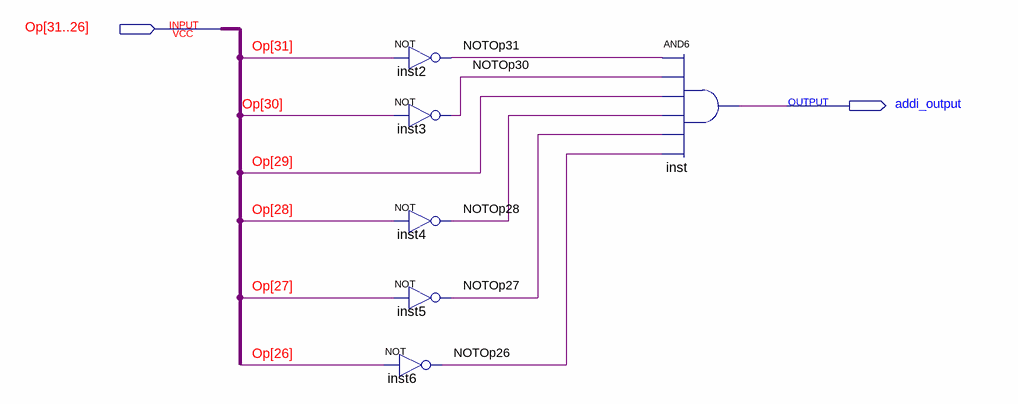
[diagram p0: schematic sheet]
// Quartus schematic ADDI.bdf as structural Verilog: 6 symbols, 2 pins
module ADDI (
  input  [31:26] Op,
  output addi_output
);

  wire NOTOp26, NOTOp27, NOTOp28, NOTOp30, NOTOp31;

  not inst2 (NOTOp31, Op[31]);
  not inst3 (NOTOp30, Op[30]);
  not inst4 (NOTOp28, Op[28]);
  not inst5 (NOTOp27, Op[27]);
  not inst6 (NOTOp26, Op[26]);
  and inst (addi_output, NOTOp31, NOTOp30, Op[29], NOTOp28, NOTOp27, NOTOp26);
endmodule
